# Altium schematic sheet connector.SchDoc: Control Plane
size Letter; Author: Ye-Sheng Kuo; Revision: 2; SheetNumber: 6; SheetTotal: 8
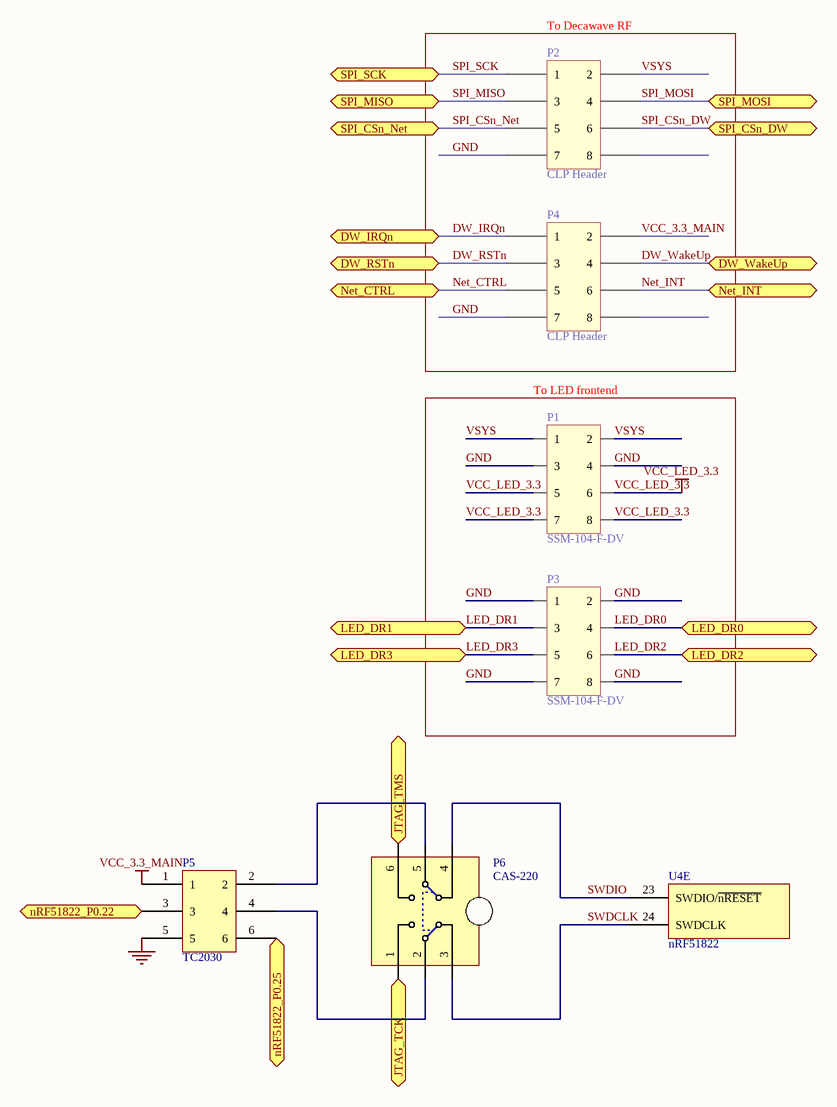
[diagram p0: connector.SchDoc]

## Parts
P1  SSM-104-F-DV  [SSM-104-F-DV]
P2  CLP Header  [SAM_CLP_2_4]
P3  SSM-104-F-DV  [SSM-104-F-DV]
P4  CLP Header  [SAM_CLP_2_4]
P5  TC2030  [TC2030-IDC-NLFP]
P6  CAS-220  [CAS-220A]
U4  nRF51822  [QFN-48]  (part E of 5)

## Blocks framed on the sheet
To Decawave RF: P2 P4
To LED frontend: P1 P3

## Ports
DW_IRQn, DW_RSTn, DW_WakeUp, JTAG_TCK, JTAG_TMS, LED_DR0, LED_DR1, LED_DR2, LED_DR3, Net_CTRL, Net_INT, nRF51822_P0.22, nRF51822_P0.25, SPI_CSn_DW, SPI_CSn_Net, SPI_MISO, SPI_MOSI, SPI_SCK

## Nets
GND: P1.3 P1.4 P2.7 P3.1 P3.2 P3.7 P3.8 P4.7 P5.5
VCC_3.3_MAIN: P4.2 P5.1
VCC_LED_3.3: P1.5 P1.6 P1.7 P1.8
DW_IRQn: P4.1 ; port DW_IRQn
DW_RSTn: P4.3 ; port DW_RSTn
DW_WakeUp: P4.4 ; port DW_WakeUp
JTAG_TCK: P6.1 ; port JTAG_TCK
JTAG_TMS: P6.6 ; port JTAG_TMS
LED_DR0: P3.4 ; port LED_DR0
LED_DR1: P3.3 ; port LED_DR1
LED_DR2: P3.6 ; port LED_DR2
LED_DR3: P3.5 ; port LED_DR3
Net_CTRL: P4.5 ; port Net_CTRL
Net_INT: P4.6 ; port Net_INT
nRF51822_P0.22: P5.3 ; port nRF51822_P0.22
nRF51822_P0.25: P5.6 ; port nRF51822_P0.25
SPI_CSn_DW: P2.6 ; port SPI_CSn_DW
SPI_CSn_Net: P2.5 ; port SPI_CSn_Net
SPI_MISO: P2.3 ; port SPI_MISO
SPI_MOSI: P2.4 ; port SPI_MOSI
SPI_SCK: P2.1 ; port SPI_SCK
SWDCLK: P6.3 U4.24(SWDCLK)
SWDIO: P6.4 U4.23(SWDIO/~{nRESET})
VSYS: P1.1 P1.2 P2.2
NetP5_2: P5.2 P6.5
NetP5_4: P5.4 P6.2

Not connected (* = marked no-connect by the designer): P2 8; P4 8

## Notes on the sheet
- Title
- Date:
- Author:
- Revision:
- Sheet
- of
- University of Michigan
- File:

## Library data of the parts
P1 P3 = SSM-104-F-DV: Samtec 2x4 100 mil female connector
P2 P4 = CLP Header: Samtec CLP 2x4 0.05" Female Header
P5 = TC2030: TC2030-MCP-NL
P6 = CAS-220: DPDT dip switch; Supplier 1: Digi-Key; Supplier Part Number 1: CAS220JCT-ND
U4 = nRF51822: Multiprotocol Bluetooth® low energy/2.4 GHz RF System on Chip; Supplier 1: Digi-Key; Supplier Part Number 1: 1490-1032-1-ND